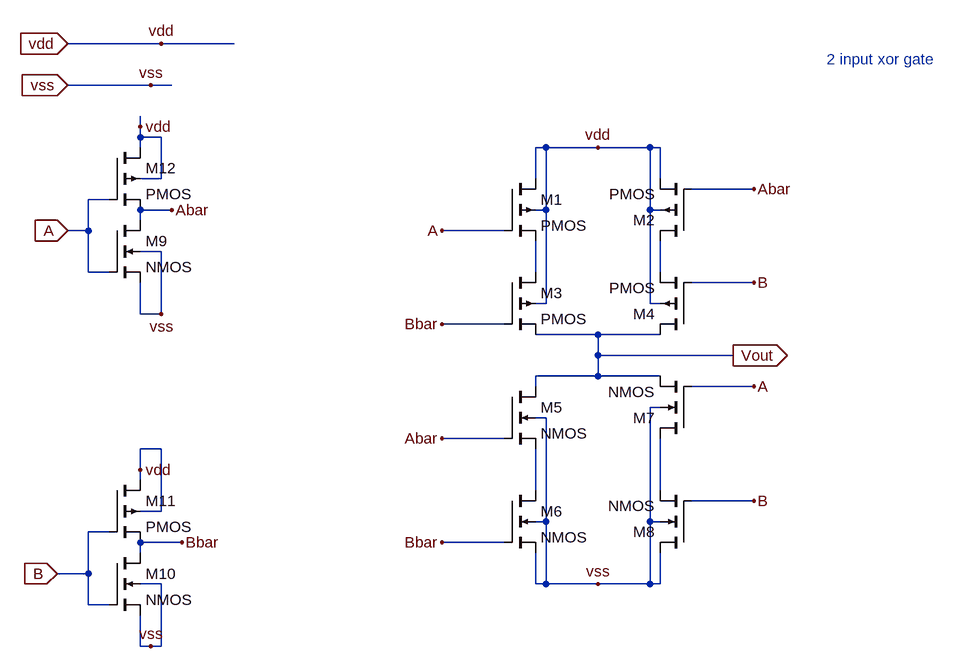
[diagram p0: schematic xor.asc]
xor.asc, the LTspice schematic file:
Version 4
SHEET 1 880 816
WIRE -416 -176 -560 -176
WIRE -304 -176 -416 -176
WIRE -432 -112 -560 -112
WIRE -400 -112 -432 -112
WIRE -448 -48 -448 -64
WIRE -448 -32 -448 -48
WIRE -416 -32 -448 -32
WIRE -448 -16 -448 -32
WIRE 176 -16 160 -16
WIRE 256 -16 176 -16
WIRE 336 -16 256 -16
WIRE 352 -16 336 -16
WIRE -416 32 -416 -32
WIRE -416 32 -448 32
WIRE 160 32 160 -16
WIRE 352 32 352 -16
WIRE 496 48 400 48
WIRE -496 64 -528 64
WIRE -400 80 -448 80
WIRE 176 80 176 -16
WIRE 176 80 160 80
WIRE 336 80 336 -16
WIRE 352 80 336 80
WIRE -448 96 -448 80
WIRE -528 112 -528 64
WIRE -528 112 -560 112
WIRE 112 112 16 112
WIRE -416 144 -448 144
WIRE -528 176 -528 112
WIRE -496 176 -528 176
WIRE 160 176 160 128
WIRE 352 176 352 128
WIRE 496 192 400 192
WIRE 176 224 176 80
WIRE 176 224 160 224
WIRE 336 224 336 80
WIRE 352 224 336 224
WIRE -448 240 -448 192
WIRE -416 240 -416 144
WIRE -416 240 -448 240
WIRE 112 256 16 256
WIRE 256 272 160 272
WIRE 352 272 256 272
WIRE 256 304 256 272
WIRE 464 304 256 304
WIRE 256 336 256 304
WIRE 256 336 160 336
WIRE 352 336 256 336
WIRE 160 352 160 336
WIRE 496 352 400 352
WIRE 352 384 336 384
WIRE 176 400 160 400
WIRE 112 432 16 432
WIRE -416 448 -448 448
WIRE -448 480 -448 448
WIRE -448 496 -448 480
WIRE 160 512 160 448
WIRE 352 512 352 432
WIRE 496 528 400 528
WIRE -416 544 -416 448
WIRE -416 544 -448 544
WIRE 176 560 176 400
WIRE 176 560 160 560
WIRE 336 560 336 384
WIRE 352 560 336 560
WIRE -496 576 -528 576
WIRE -384 592 -448 592
WIRE 112 592 16 592
WIRE -448 608 -448 592
WIRE -528 640 -528 576
WIRE -528 640 -576 640
WIRE -416 656 -448 656
WIRE 160 656 160 608
WIRE 176 656 176 560
WIRE 176 656 160 656
WIRE 256 656 176 656
WIRE 336 656 336 560
WIRE 336 656 256 656
WIRE 352 656 352 608
WIRE 352 656 336 656
WIRE -528 688 -528 640
WIRE -496 688 -528 688
WIRE -448 752 -448 704
WIRE -432 752 -448 752
WIRE -416 752 -416 656
WIRE -416 752 -432 752
FLAG -560 112 A
IOPIN -560 112 In
FLAG -576 640 B
IOPIN -576 640 In
FLAG -560 -176 vdd
IOPIN -560 -176 In
FLAG -560 -112 vss
IOPIN -560 -112 In
FLAG 16 112 A
FLAG 496 352 A
FLAG -400 80 Abar
FLAG 16 256 Bbar
FLAG 16 432 Abar
FLAG 496 48 Abar
FLAG 496 528 B
FLAG -384 592 Bbar
FLAG 16 592 Bbar
FLAG 496 192 B
FLAG -416 -176 vdd
FLAG -448 -48 vdd
FLAG -448 480 vdd
FLAG 256 -16 vdd
FLAG -432 -112 vss
FLAG -416 240 vss
FLAG -432 752 vss
FLAG 256 656 vss
FLAG 464 304 Vout
IOPIN 464 304 Out
SYMBOL pmos4 112 32 R0
SYMATTR InstName M1
SYMATTR Value2 l=180nm w=1440nm
SYMBOL pmos4 400 128 R180
SYMATTR InstName M2
SYMATTR Value2 l=180nm w=1440nm
SYMBOL pmos4 112 176 R0
SYMATTR InstName M3
SYMATTR Value2 l=180nm w=1440nm
SYMBOL pmos4 400 272 R180
SYMATTR InstName M4
SYMATTR Value2 l=180nm w=1440nm
SYMBOL nmos4 112 352 R0
SYMATTR InstName M5
SYMATTR Value2 l=180nm w=720nm
SYMBOL nmos4 112 512 R0
SYMATTR InstName M6
SYMATTR Value2 l=180nm w=720nm
SYMBOL nmos4 400 432 R180
SYMATTR InstName M7
SYMATTR Value2 l=180nm w=720nm
SYMBOL nmos4 400 608 R180
SYMATTR InstName M8
SYMATTR Value2 l=180nm w=720nm
SYMBOL nmos4 -496 96 R0
SYMATTR InstName M9
SYMATTR Value2 l=180nm w=360nm
SYMBOL nmos4 -496 608 R0
SYMATTR InstName M10
SYMATTR Value2 l=180nm w=360nm
SYMBOL pmos4 -496 496 R0
SYMATTR InstName M11
SYMATTR Value2 l=180n w=720n
SYMBOL pmos4 -496 -16 R0
SYMATTR InstName M12
SYMATTR Value2 l=180n w=720n
TEXT 608 -152 Left 2 ;2 input xor gate

The netlist it stands for:
* xor.asc
M1 vdd A N001 vdd PMOS l=180nm w=1440nm
M2 N002 Abar vdd vdd PMOS l=180nm w=1440nm
M3 N001 Bbar Vout vdd PMOS l=180nm w=1440nm
M4 Vout B N002 vdd PMOS l=180nm w=1440nm
M5 Vout Abar N003 vss NMOS l=180nm w=720nm
M6 N003 Bbar vss vss NMOS l=180nm w=720nm
M7 N004 A Vout vss NMOS l=180nm w=720nm
M8 vss B N004 vss NMOS l=180nm w=720nm
M9 Abar A vss vss NMOS l=180nm w=360nm
M10 Bbar B vss vss NMOS l=180nm w=360nm
M11 vdd B Bbar vdd PMOS l=180n w=720n
M12 vdd A Abar vdd PMOS l=180n w=720n
.model NMOS NMOS
.model PMOS PMOS
.lib standard.mos
* 2 input xor gate
.backanno
.end